# Altium schematic sheet PCB1_schematic.SchDoc
size A; SheetNumber: 1; SheetTotal: 4
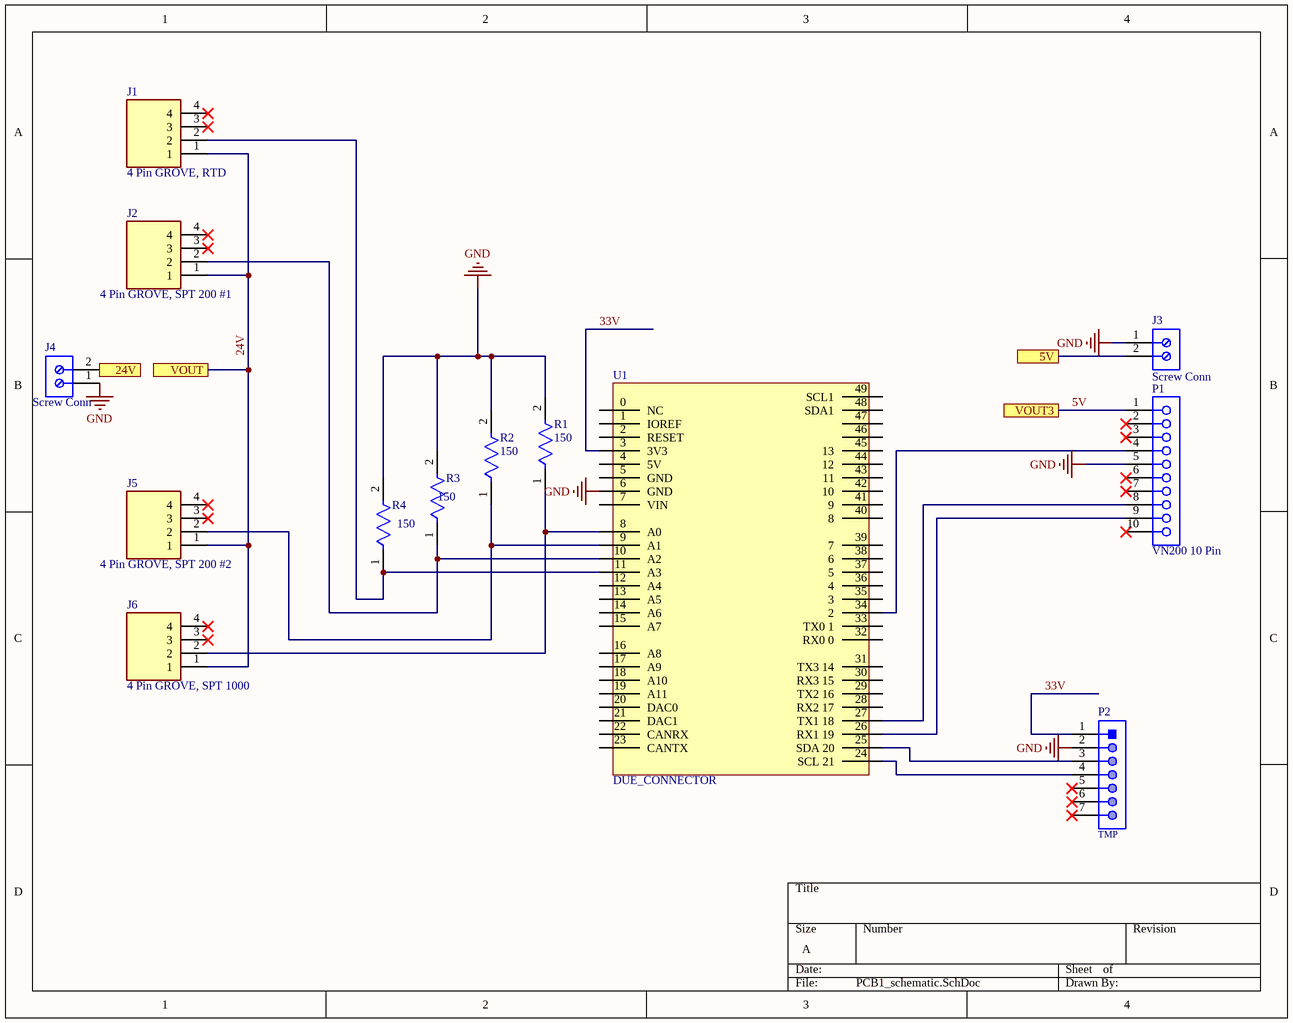
[diagram p0: PCB1_schematic.SchDoc]

## Parts
J1  4 Pin GROVE, RTD  [SEEED_110990030]
J2  4 Pin GROVE, SPT 200 #1  [SEEED_110990030]
J3  Screw Conn  [PHOE-1714955_V]
J4  Screw Conn  [PHOE-1714955_V]
J5  4 Pin GROVE, SPT 200 #2  [SEEED_110990030]
J6  4 Pin GROVE, SPT 1000  [SEEED_110990030]
P1  VN200 10 Pin  [MOLX-52806-1010]
P2  TMP  [61300711121]
R1  150  [FP-MBA0204-MFG]
R2  150  [FP-MBA0204-MFG]
R3  150  [FP-MBA0204-MFG]
R4  150  [FP-MBA0204-MFG]
U1  DUE_CONNECTOR  [DUE_FOOTPRINT]

## Ports
5V, 24V, VOUT, VOUT3

## Nets
GND: J3.1 J4.1 P1.5 P2.2 R1.2 R2.2 R3.2 R4.2 U1.6(GND)
5V: P1.1 ; port VOUT3
5V: J3.2 ; port 5V  [a separate net that carries the same name]
24V: J1.1 J2.1 J5.1 J6.1 ; port VOUT
24V: J4.2 ; port 24V  [a separate net that carries the same name]
33V: P2.1 U1.3(3V3)
NetJ1_2: J1.2 R4.1 U1.11(A3)
NetJ2_2: J2.2 R3.1 U1.10(A2)
NetJ5_2: J5.2 R2.1 U1.9(A1)
NetJ6_2: J6.2 R1.1 U1.8(A0)
NetP1_4: P1.4 U1.34(2)
NetP1_8: P1.8 U1.27(TX1_18)
NetP1_9: P1.9 U1.26(RX1_19)
NetP2_3: P2.3 U1.25(SDA_20)
NetP2_4: P2.4 U1.24(SCL_21)

Not connected (* = marked no-connect by the designer): J1 3* 4*; J2 3* 4*; J5 3* 4*; J6 3* 4*; P1 2* 3* 6* 7* 10*; P2 5* 6* 7*; U1 0(NC) 1(IOREF) 2(RESET) 4(5V) 5(GND) 7(VIN) 12(A4) 13(A5) 14(A6) 15(A7) 16(A8) 17(A9) 18(A10) 19(A11) 20(DAC0) 21(DAC1) 22(CANRX) 23(CANTX) 28(RX2_17) 29(TX2_16) 30(RX3_15) 31(TX3_14) 32(RX0_0) 33(TX0_1) 35(3) 36(4) 37(5) 38(6) 39(7) 40(8) 41(9) 42(10) 43(11) 44(12) 45(13) 46 47 48(SDA1) 49(SCL1)

## Library data of the parts
J1 J2 J5 J6 = 110990030: GROVE 2MM 4PIN VERT CONN 10PCS; MF: Seeed Technology; Arrow_Electronics-Purchase-URL: https://snapeda.com/shop?store=Arrow+Electronics&id=583576; Availability: Good; Package: None; Price: None; Mouser-Purchase-URL: https://snapeda.com/shop?store=Mouser&id=583576; MP: 110990030; SnapEDA_Link: https://www.snapeda.com/parts/110990030/Seeed%20Technology%20Co.,%20Ltd/view-part/583576/?ref=snap; Value: *
J3 J4 = CMP-2000-05797-1: PC Terminal Block, Pitch 6.35 mm, 1 x 2 Position, Height 21.5 mm, Tail Lenght 5.1 mm, RoHS, Bulk; Manufacturer: Phoenix Contact; Package Description: PC Terminal Block, Pitch 6.35 mm, 1 x 2 Position, Height 21.5 mm, Tail Lenght 5.1 mm; Datasheet URL: http://media.digikey.com/pdf/Data%20Sheets/Phoenix%20Contact%20PDFs/1714955.pdf; Package Reference: 1714955; Manufacturer URL: http://www.phoenixcontact.com/; Datasheet Version: 02/2010; Mounting Technology: ThroughHole
P1 = CMP-1242-00167-1: 1.0 mm Pitch FFC Connector, 5.4 mm Mated Height, Vertical, Non-ZIF, Through Hole, 10 Circuits, -20 to 80 degC, ELV and RoHS Compliant, Tray; PartNumber: 52806-1010; Manufacturer: Molex; PCB Retention: None; Circuits (maximum): 10; Polarized to PCB: No; Mated Height: 5.40mm; Current (Max per Contact): 0.5A; Material - Plating Mating: Tin; Material - Metal: Phosphor Bronze; Pitch - Termination Interface: 1.00mm; Voltage (Max): 50V AC (RMS)/DC; Mounting Technology: Through Hole; Orientation: Vertical; ComponentLink2Description: Datasheet; Contact Position: N/A; Number of Rows: 1; ComponentLink1URL: http://www.molex.com/molex/index.jsp; RoHS: TRUE; Packing: Tray; PackageReference: 52806-1010; Entry Angle: Vertical; PackageDescription: 10-Lead FFC Connector, Pitch 1.0 mm; PCB Locator: No; Circuits (Loaded): 10; PackageVersion: Rev. B, 08/2002; Material - Plating Termination: Tin; ComponentLink2URL: http://www.molex.com/webdocs/datasheets/pdf/en-us/0528061010_FFC_FPC_CONNECTORS.pdf; Stackable: No; ComponentLink1Description: Manufacturer URL; ComponentLink3URL: http://www.molex.com/pdm_docs/sd/528061010_sd.pdf; Durability (mating cycles max): 10; Pitch - Mating Interface: 1.00mm; ComponentLink3Description: Package Specification
P2 = CMP-1502-01074-1: THT Vertical Pin Header WR-PHD, Pitch 2.54 mm, Single Row, 7 pins; Manufacturer: Wurth Elektronik; Pin Number: 7; Gender: Male; Working Voltage: 250VAC; Contact Resistance: 20mOhm; Rated Current: 3A; Pitch: 2.54mm; Withstanding Voltage: 500VAC; Row Number: Single; Packaging: Bag; Orientation: Vertical; Manufacturer URL: http://www.we-online.de; Datasheet URL: https://katalog.we-online.de/em/datasheet/6130xx11121.pdf; Part Number: 61300711121; Publisher: WurthElektronik; Operating Temperature: -40to105degC; Mounting Technology: THT; Package Reference: 61300711121
R1-R4 = CMP-02408-000005-1: RES 220 OHM 0.4W 1% AXIAL; Manufacturer Part Number: MBA02040C2200FC100; Manufacturer: Vishay BC Components; Automotive Grade: Grade 1; Value: 220Ω; Voltage Rating: 200V; Temperature Coefficient: 50ppm/°C; Power Rating: 0.25W; Digikey Description: RES 220 OHM 0.4W 1% AXIAL; Height: 1.6mm; Automotive: Yes; Lead Free: Yes; Mouser Description: Thin Film Resistors - Through Hole .4watt 220ohms 1% 1/8watt body size; Temperature Range Low: -55°C; ComponentLink2Description: Datasheet; Temperature: -55°C to +125°C; Device Class L3: Through-Hole Resistors; Ipc Land Pattern Name: RESAD500W65L360D160; Octopart: https://octopart.com/mba02040c2200fc100-vishay-43743094; Series: MBA/SMA 0204; RoHS: TRUE; Tolerance: 1%; Package: MBA0204; Device Class L1: Passive Components; ComponentLink2URL: http://www.vishay.com/docs/28766/mbxsma.pdf; Category: Res; Composition: Metal Film; Device Class L2: Resistors; Temperature Range High: +125°C; Resistance: 220Ω